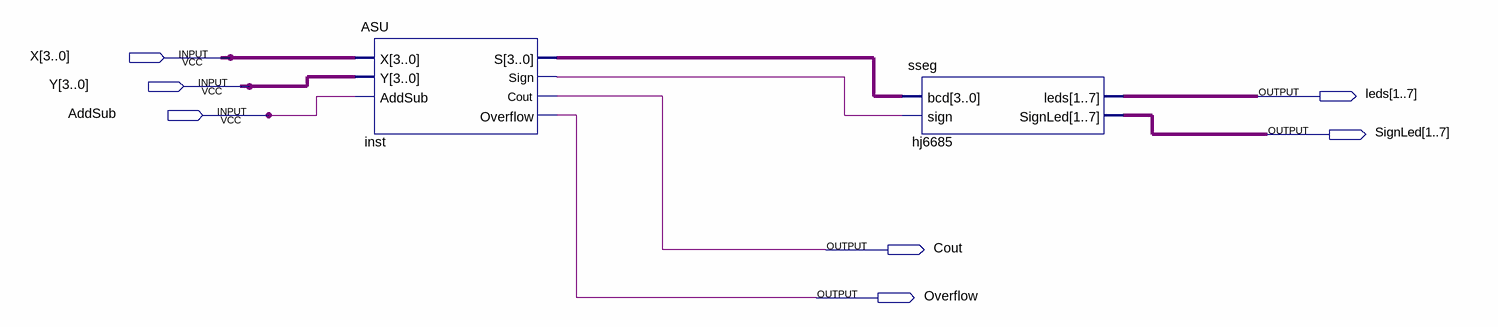
[diagram p0: schematic sheet]
// Quartus schematic CombinedASU1.bdf as structural Verilog: 2 symbols, 7 pins
module CombinedASU1 (
  input  [3:0] X,
  input  [3:0] Y,
  input  AddSub,
  output [1:7] leds,
  output [1:7] SignLed,
  output Cout,
  output Overflow
);

  wire inst_sign;
  wire [3:0] inst_s;

  ASU inst (.X(X), .Y(Y), .AddSub(AddSub), .S(inst_s), .Sign(inst_sign), .Cout(Cout), .Overflow(Overflow));
  sseg hj6685 (.bcd(inst_s), .sign(inst_sign), .leds(leds), .SignLed(SignLed));
endmodule
